# EAGLE design MyPulseSensor (EAGLE 6.5.0)
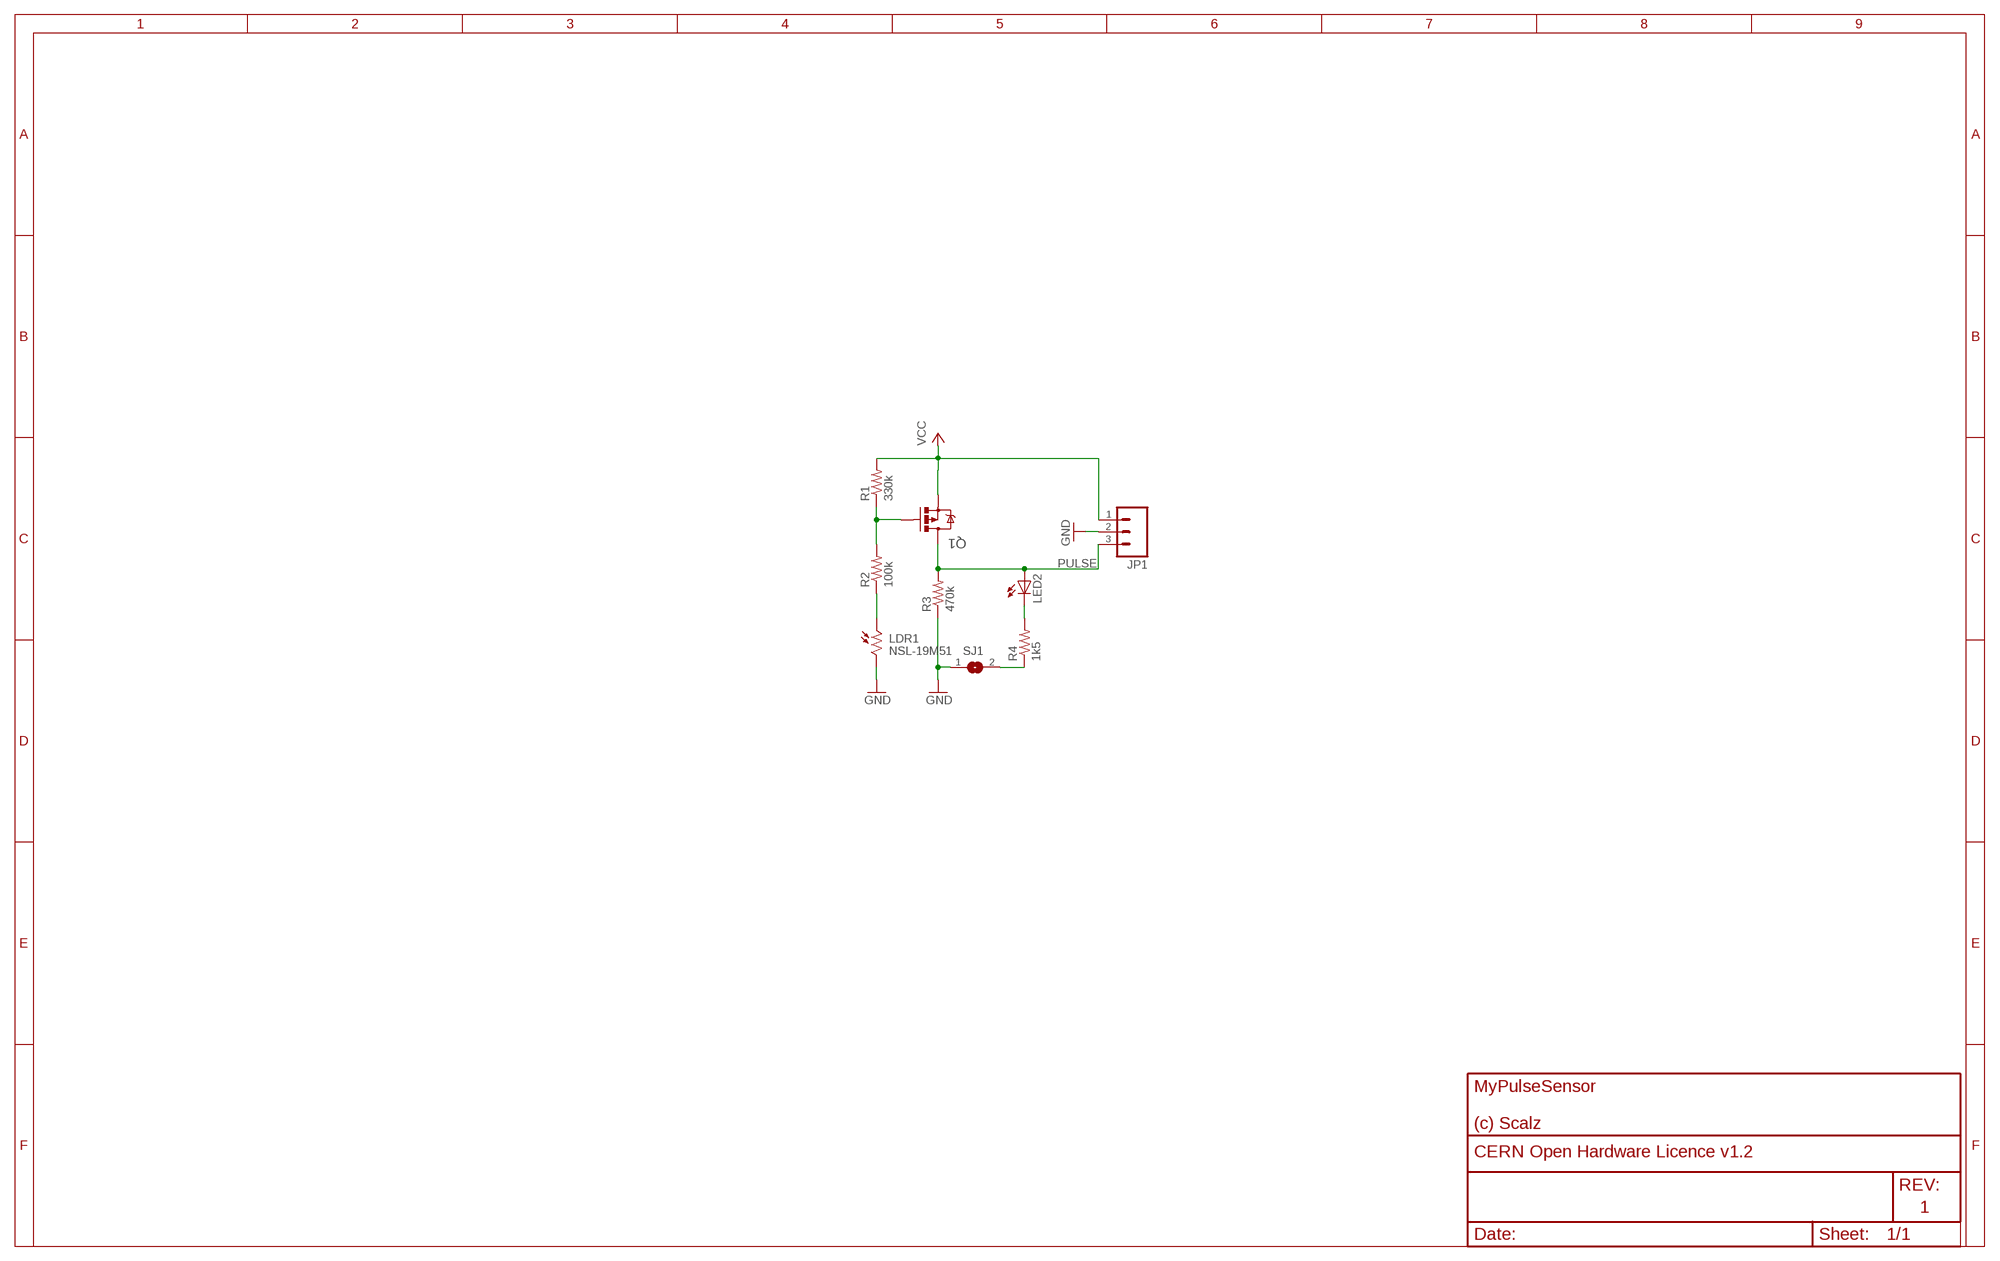
[diagram p0: schematic, sheet 1]

## Parts
JP1  M03PTH  [1X03]
LDR1  NSL-19M51  [PHOTORESISTOR_TO18]
LED2  LED5MM  [LED5MM]
Q1  SI2399DS-T1-GE3  [SOT95P237X112-3N]
R1  330k  RESISTOR0603-RES  [0603-RES]
R2  100k  RESISTOR0603-RES  [0603-RES]
R3  470k  RESISTOR0603-RES  [0603-RES]
R4  1k5  RESISTOR0603-RES  [0603-RES]
SJ1  SJ  [SJ]

## Nets
GND: JP1.2 LDR1.2 R3.1 SJ1.1
N$1: Q1.1(G) R1.1 R2.2
N$2: LDR1.1 R2.1
N$3: LED2.K(C) R4.2
N$4: R4.1 SJ1.2
PULSE: JP1.3 LED2.A Q1.3(D) R3.2
VCC: JP1.1 Q1.2(S) R1.2

## Library data of the parts
JP1 = SparkFun-Connectors:M03: Header 3 Standard 3-pin 0.1" header. Use with straight break away headers (SKU : PRT-00116), right angle break away headers (PRT-00553), swiss pins (PRT-00743), machine pins (PRT-00117), and female headers (PRT-00115). Molex polarized connector foot print use with SKU : PRT-08232 with associated crimp pins and housings.
LDR1 = pulsesensor:NSL-19M51
LED2 = adafruit:LED: LED OSRAM: - CHIPLED LG R971, LG N971, LY N971, LG Q971, LY Q971, LO R971, LY R971 LH N974, LH R974 LS Q976, LO Q976, LY Q976 LO Q996 - Hyper CHIPLED LW Q18S LB Q993, LB Q99A, LB R99A - SideLED LS A670, LO A670, LY A670, LG A670, LP A670 LB A673, LV A673, LT A673, LW A673 LH A674 LY A675 LS A676, LA A676, LO A676, LY A676, LW A676 LS A679, LY A679, LG A679 - Hyper Micro SIDELED® LS Y876, LA Y876, LO Y876, LY Y876 LT Y87S - SmartLED LW L88C, LW L88S LB L89C, LB L89S, LG L890 LS L89K, LO L89K, LY L89K LS L896, LA L896, LO L896, LY L896 - TOPLED LS T670, LO T670, LY T670, LG T670, LP T670 LSG T670, LSP T670, LSY T670, LOP T670, LYG T670 LG T671, LOG T671, LSG T671 LB T673, LV T673, LT T673, LW T673 LH T674 LS T676, LA T676, LO T676, LY T676, LB T676, LH T676, LSB T676, LW T676 LB T67C, LV T67C, LT T67C, LS T67K, LO T67K, LY T67K, LW E67C LS E67B, LA E67B, LO E67B, LY E67B, LB E67C, LV E67C, LT E67C LW T67C LS T679, LY T679, LG T679 LS T770, LO T770, LY T770, LG T770, LP T770 LB T773, LV T773, LT T773, LW T773 LH T774 LS E675, LA E675, LY E675, LS T675 LS T776, LA T776, LO T776, LY T776, LB T776 LHGB T686 LT T68C, LB T68C - Hyper Mini TOPLED® LB M676 - Mini TOPLED Santana® LG M470 LS M47K, LO M47K, LY M47K Source: http://www.osram.convergy.de/
Q1 = pulsesensor:SI2399DS-T1-GE3: P-Channel 20-V (D-S) MOSFET; MPN: SI2399DS-T1-GE3; OC_FARNELL: 2056681; OC_NEWARK: 64T4058; PACKAGE: SOT-23-3; SUPPLIER: VISHAY SILICONIX
R1-R4 = LowPowerLab:RESISTOR: Resistor Basic schematic elements and footprints for 0603, 1206, and PTH resistors.
SJ1 = jumper:SJ: SMD solder JUMPER

## Board
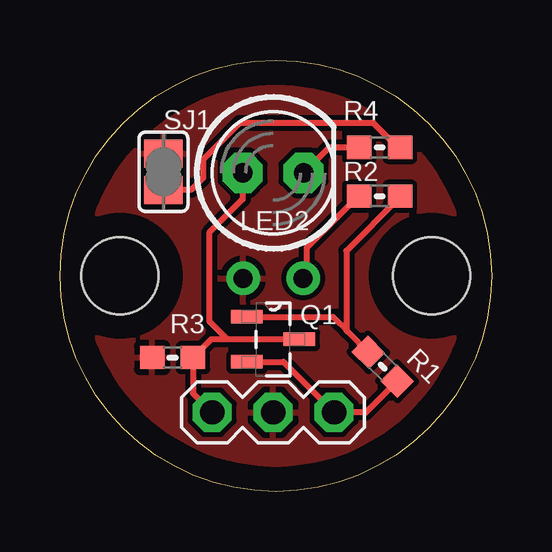
[diagram p1: board, top side]
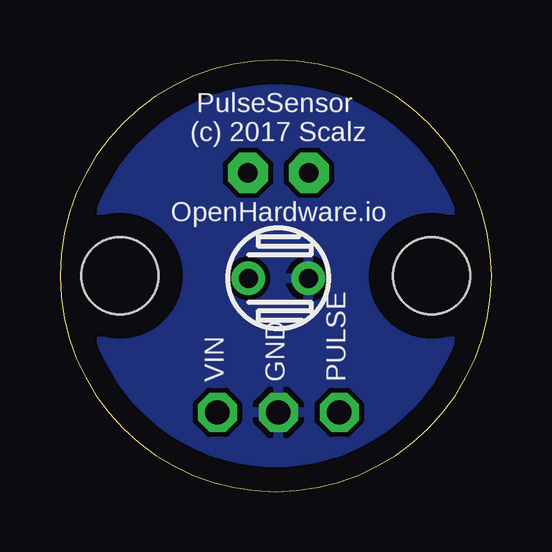
[diagram p2: board, bottom side, seen from below]

Size 18 x 18 mm. Coordinates in mm from the lower left corner, seen from the top.
Outline: 9,0 arc-180 9,18 arc-180 9,0
Copper layers (1*16): Top 0.035mm / dielectric 1.5mm / Bottom 0.035mm
Design rules "default": minimum track width 10mil, minimum drill 24mil, track to track 8mil, track to pad 8mil, pad to pad 8mil, via to via 8mil, smd to smd 8mil, copper to edge 40mil, drill to drill 8mil, minimum pad ring 10mil, minimum via ring 8mil, stop-mask expansion 4mil, vias tented up to drill 0mil, thermal gap 10mil
Holes 3.2 mm at 2.5,9 15.5,9

### Footprints (pad centres in the part's own frame; a part is rotated, then mirrored left to right if it is on the bottom)
1X03 = drill 1.016 pad 1.626 octagon: 1 0,0; 2 2.54,0; 3 5.08,0
PHOTORESISTOR_TO18 = drill 0.8 pad 1.4: 1 -1.25,0; 2 1.25,0
LED5MM = drill 0.813 pad 1.676 octagon: A -1.27,0; K 1.27,0
SOT95P237X112-3N = smd 1.321 x 0.559: 1 -1.092,0.94; 2 -1.092,-0.94; 3 1.092,0
0603-RES = smd 1.016 x 0.965: 1 -0.85,0; 2 0.85,0
SJ = smd 1.168 x 1.6: 1 -0.762,0; 2 0.762,0

### Placement (x,y rotation side)
JP1  11.43,3.3 180 top
LDR1  8.89,8.89 0 bottom
LED2  8.89,13.29 0 top
Q1  8.89,6.35 0 top
R1  13.46,5.21 315 top
R2  13.34,12.32 0 top
R3  4.7,5.59 0 top
R4  13.34,14.35 180 top
SJ1  4.32,13.34 270 top

### Tracks (layer width: path | path; a pad name or v marks a point on that pad's centre or on a via)
GND
  pour Top: -2.54,19.05 20.32,19.05 20.32,-1.27 -2.54,-1.27
  pour Bottom: -5.08,20.32 21.59,20.32 21.59,-5.08 -5.08,-5.08
N$1
  Top 0.254: Q1.1 11.38,7.29 12,6.67 | 12,6.67 R1.1 | R2.2 14.19,12.28 11.94,10.03 11.94,6.73 12,6.67
N$2
  Top 0.254: R2.1 12.45,12.32 10.29,10.16 10.29,9.02 10.27,9.02 LDR1.1
N$3
  Top 0.254: R4.2 11.22,14.35 LED2.K
N$4
  Top 0.254: R4.1 14.1,14.35 13.08,15.37 7.49,15.37 5.97,13.84 5.97,13.08 5.46,12.57 SJ1.2
PULSE
  Top 0.254: Q1.3 6.99,6.35 | 6.99,6.35 6.31,6.35 R3.2 5.55,4.1 JP1.3 | LED2.A 7.62,12.19 6.22,10.79 6.22,7.11 6.99,6.35
VCC
  Top 0.254: Q1.2 9.32,5.41 JP1.1 12.76,3.3 R1.2

### Text on the board
bPlace: PulseSensor / (c) 2017 Scalz | OpenHardware.io | PULSE | GND | VIN